# EAGLE design Yam_Thwoll_Ommo (EAGLE 9.6.2)
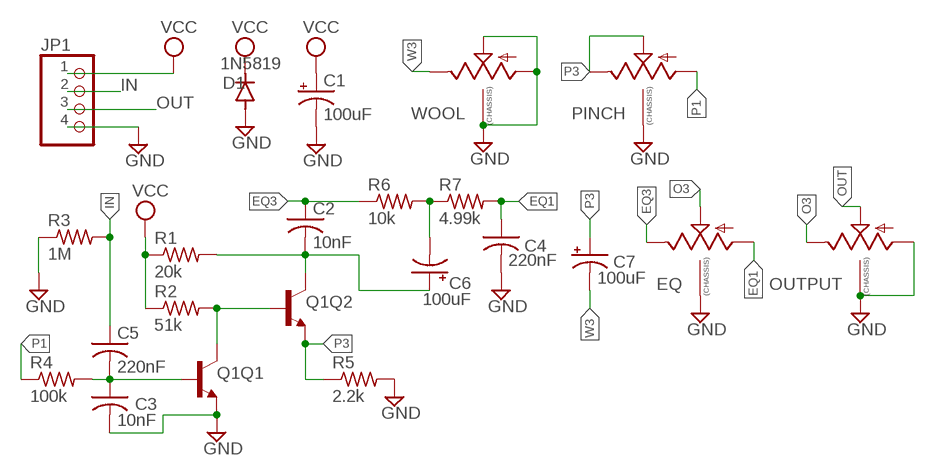
[diagram p0: schematic, sheet 1]

## Parts
C1  100uF  CAP_SMD+THRUPAN_B  [PAN_B_SMD+THRU]
C2  10nF  C-USC0402  [C0402]
C3  10nF  C-USC0402  [C0402]
C4  220nF  C-USC0402  [C0402]
C5  220nF  C-USC0402  [C0402]
C6  100uF  CAP_SMD+THRUPAN_B  [PAN_B_SMD+THRU]
C7  100uF  CAP_SMD+THRUPAN_B  [PAN_B_SMD+THRU]
D1  1N5819  DIODE-SOD123  [SOD123]
EQ  9MM_SNAP-IN_POT_CHASSIS  [9MM_SNAP-IN_POT]
JP1  PINHD-1X4  [1X04]
OUTPUT  9MM_SNAP-IN_POT_CHASSIS  [9MM_SNAP-IN_POT]
PINCH  9MM_SNAP-IN_POT_CHASSIS  [9MM_SNAP-IN_POT]
Q1  TRANS_NPN_DUAL-MBT3904DW1T1  [SC70-6]
R1  20k  R-US_R0402  [R0402]
R2  51k  R-US_R0402  [R0402]
R3  1M  R-US_R0402  [R0402]
R4  100k  R-US_R0402  [R0402]
R5  2.2k  R-US_R0402  [R0402]
R6  10k  R-US_R0402  [R0402]
R7  4.99k  R-US_R0402  [R0402]
WOOL  9MM_SNAP-IN_POT_CHASSIS  [9MM_SNAP-IN_POT]

## Nets
EQ1: C4.1 EQ.1(A) R7.2
EQ3: C2.1 EQ.3(E) R6.1
GND: C1.- C1.--(-) C3.2 C4.2 D1.A EQ.CHASSIS1 EQ.CHASSIS2 JP1.4 OUTPUT.1(A) OUTPUT.CHASSIS1 OUTPUT.CHASSIS2 PINCH.CHASSIS1 PINCH.CHASSIS2 Q1.4(Q1:E) R3.1 R5.2 WOOL.1(A) WOOL.2(S) WOOL.CHASSIS1 WOOL.CHASSIS2
IN: C5.1 JP1.2 R3.2
N$1: Q1.2(Q2:B) Q1.3(Q1:C) R2.2
N$2: C2.2 C6.+ C6.++(+) Q1.6(Q2:C) R1.2
N$3: C6.- C6.--(-) R6.2 R7.1
N$5: C3.1 C5.2 Q1.5(Q1:B) R4.2
O3: EQ.2(S) OUTPUT.3(E)
OUT: JP1.3 OUTPUT.2(S)
P1: PINCH.1(A) R4.1
P3: C7.+ C7.++(+) PINCH.2(S) PINCH.3(E) Q1.1(Q2:E) R5.1
VCC: C1.+ C1.++(+) D1.C JP1.1 R1.1 R2.1
W3: C7.- C7.--(-) WOOL.3(E)

## Library data of the parts
C1 C6 C7 = MusicThingModular:CAP_SMD+THRU
C2-C5 = adafruit:C-US: CAPACITOR, American symbol
D1 = diode:DIODE-: DIODE
EQ OUTPUT PINCH WOOL = MusicThingModular:9MM_SNAP-IN_POT_CHASSIS: 9mm vertical snap-in pot, Alpha / Panasonic style, with a connection to the metal chassis for grounding
JP1 = Connector:PINHD-1X4: PIN HEADER; CATEGORY: CONNECTOR; SUB-CATEGORY: PIN-HEADER
Q1 = SparkFun-DiscreteSemi:TRANS_NPN_DUAL: Dual NPN Transistors in Single Package The MBT3904W1 puts two general purpose 3904 NPN transistors in a single package. Datasheet <http://www.onsemi.com/pub_link/Collateral/MBT3904DW1T1-D.PDF> SparkFun Products: SparkFun ESP32 Thing <https://www.sparkfun.com/products/13907>; PROD_ID: TRANS-13337
R1-R7 = adafruit:R-US_: RESISTOR, American symbol

## Board
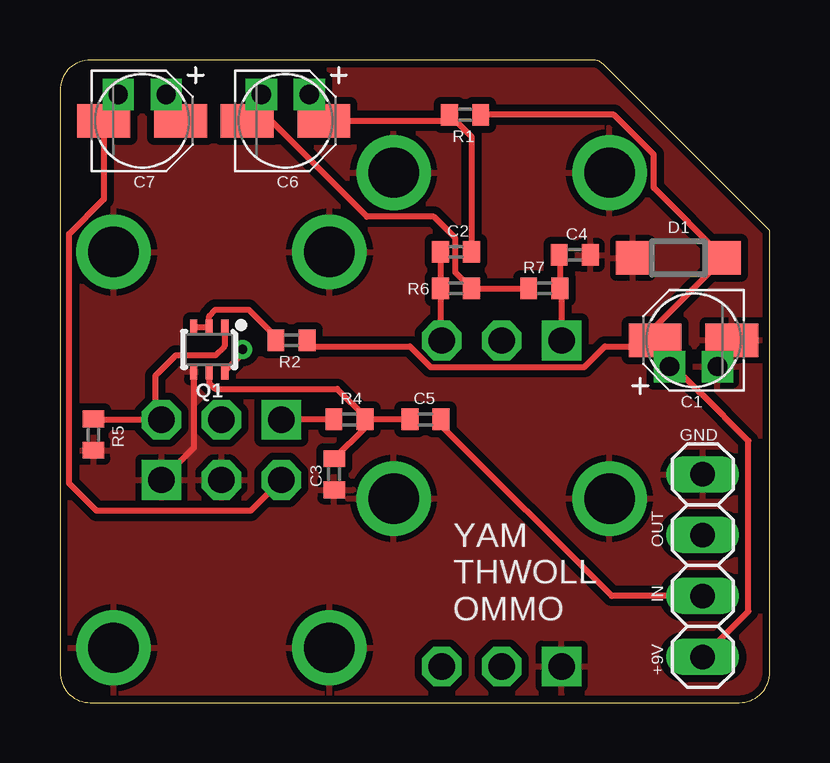
[diagram p1: board, top side]
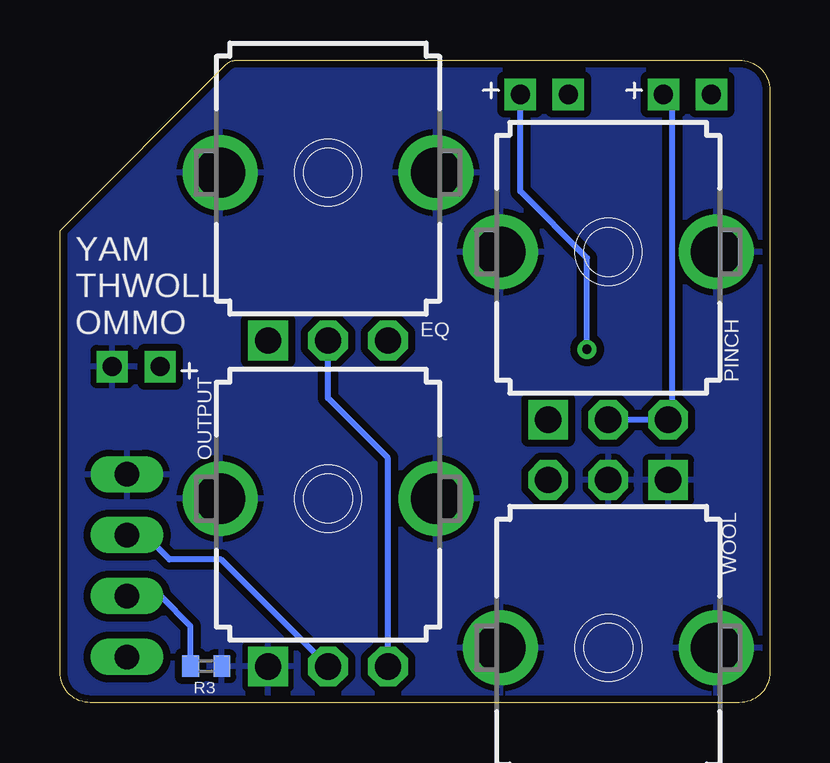
[diagram p2: board, bottom side, seen from below]

Size 29.59 x 26.8 mm. Coordinates in mm from the lower left corner, seen from the top.
Outline: 28.32,0 arc90 29.59,1.27 29.59,19.68 22.66,26.61 arc45 22.22,26.8 1.27,26.8 arc90 0,25.53 0,1.27 arc90 1.27,0 28.32,0
Copper layers (1*16): Top 0.035mm / dielectric 1.5mm / Bottom 0.035mm
Design rules "default *": minimum track width 6mil, minimum drill 0.35mm, track to track 6mil, track to pad 6mil, pad to pad 6mil, via to via 6mil, smd to smd 6mil, copper to edge 10mil, drill to drill 6mil, minimum pad ring 10mil, minimum via ring 8mil, stop-mask expansion 4mil, vias tented up to drill 0mil, thermal gap 10mil

### Footprints (pad centres in the part's own frame; a part is rotated, then mirrored left to right if it is on the bottom)
PAN_B_SMD+THRU = smd 2.2 x 1.4: + 1.6,0; - -1.6,0 | drill 0.8 pad 0.9 square: ++ 1,1.1; -- -1,1.1
C0402 = smd 0.7 x 0.9: 1 -0.65,0; 2 0.65,0
SOD123 = smd 1.4 x 1.4: A 1.9,0; C -1.9,0
9MM_SNAP-IN_POT = drill 1.1 square: 1 -2.5,-7 | drill 1.1 octagon: 2 0,-7; 3 2.5,-7 | drill 2.1 pad 2.794: CHASSIS1 -4.5,0; CHASSIS2 4.5,0
1X04 = drill 1.016 long: 1 -3.81,0; 2 -1.27,0; 3 1.27,0; 4 3.81,0
SC70-6 = smd 0.3 x 0.66: 1 -0.65,-0.92; 2 0,-0.92; 3 0.65,-0.92; 4 0.65,0.92; 5 0,0.92; 6 -0.65,0.92
R0402 = smd 0.7 x 0.9: 1 -0.65,0; 2 0.65,0

### Placement (x,y rotation side)
C1  26.42,15.11 180 top
C2  16.51,18.8 0 top
C3  11.43,9.53 270 top
C4  21.46,18.67 0 top
C5  15.24,11.81 180 top
C6  9.4,24.26 0 top
C7  3.43,24.26 0 top
D1  25.78,18.54 180 top
EQ  18.41,22.1 0 bottom
JP1  26.8,5.71 90 top
OUTPUT  18.41,8.51 0 bottom
PINCH  6.73,18.8 0 bottom
Q1  6.22,14.73 180 top
R1  16.89,24.51 180 top
R2  9.65,15.11 180 top
R3  23.5,1.52 180 bottom
R4  12.06,11.81 0 top
R5  1.4,11.18 270 top
R6  16.51,17.27 0 top
R7  20.19,17.27 0 top
WOOL  6.73,2.29 180 bottom

### Tracks (layer width: path | path; a pad name or v marks a point on that pad's centre or on a via)
EQ1
  Top 0.254: C4.1 20.84,18.64 R7.2 20.91,17.2 EQ.1
EQ3
  Top 0.254: C2.1 R6.1 15.86,15.15 EQ.3
GND
  Top 0.254: C1.-- 27.42,14.51 C1.- | Q1.4 5.57,10.63 WOOL.1
  pour Bottom (isolate 0.305): -0.64,27.3 -0.64,-0.64 30.48,-0.64 30.48,27.3
  pour Top (isolate 0.305): -0.64,27.3 -0.64,-0.64 30.48,-0.64 30.48,27.3
IN
  Top 0.254: C5.1 15.89,11.56 23,4.45 JP1.2
  Bottom 0.254: R3.2 24.14,3.19 25.4,4.45 JP1.2
N$1
  Top 0.254: Q1.3 Q1.2 6.22,16.13 6.48,16.38 7.87,16.38 9,15.26 R2.2
N$2  (via drill 0.38)
  Top 0.254: R1.2 16.5,24.26 | 16.5,24.26 17.16,23.59 C2.2 | C6.++ 10.4,24.86 C6.+ 16.5,24.26 | Q1.6 7.62,14.56 v7.62,14.73
  Bottom 0.254: C6.++ 10.4,21.32 7.62,18.54 v7.62,14.73
N$3
  Top 0.254: C6.-- 7.8,24.76 C6.- 8.8,24.26 12.8,20.26 15.59,20.26 16.49,19.36 16.49,17.94 R6.2 R7.1
N$5
  Top 0.254: C5.2 R4.2 | R4.2 12.71,11.92 11.56,13.08 6.48,13.08 6.22,13.34 Q1.5 | C3.1 12.71,11.46 R4.2
O3
  Bottom 0.254: OUTPUT.3 15.91,10.2 18.41,12.7 EQ.2
OUT
  Bottom 0.254: OUTPUT.2 22.88,5.97 25.02,5.97 26.04,6.99 JP1.3
P1
  Top 0.254: R4.1 9.25,11.81 PINCH.1
P3
  Top 0.254: R5.1 1.43,11.8 PINCH.3 3.98,12.05 3.98,13.63 4.83,14.48 6.48,14.48 6.86,14.86 6.86,15.64 Q1.1 | C7.+ 4.43,24.86 C7.++
  Bottom 0.254: C7.++ 4.07,25 4.07,11.96 PINCH.3 PINCH.2
VCC
  Top 0.254: 24.82,14.86 C1.+ 24.82,15.68 D1.C 24.75,21.47 24.75,22.86 23.1,24.51 R1.1 | 24.82,14.86 24.82,14.61 C1.++ 25.59,14.01 26.65,12.95 26.67,12.95 28.7,10.92 28.7,3.81 JP1.1 | R2.1 10.56,14.86 14.59,14.86 15.46,13.99 21.86,13.99 22.72,14.86 24.82,14.86
W3
  Top 0.254: C7.-- 1.83,24.76 C7.- 1.83,20.99 0.38,19.54 0.38,9.14 1.52,8 7.95,8 WOOL.3

### Text on the board
tPlace: GND | OUT | IN | YAM / THWOLL / OMMO | +9V
bPlace: YAM / THWOLL / OMMO